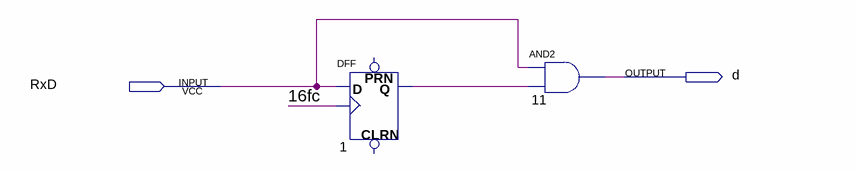
[diagram p0: schematic sheet]
// Quartus schematic sim1_1.bdf as structural Verilog: 2 symbols, 2 pins
module sim1_1 (
  input  RxD,
  output d
);

  wire \16fc , n1_q;

  DFF u_1 (.CLK(\16fc ), .D(RxD), .Q(n1_q));  // open: CLRN, PRN
  and u_11 (d, RxD, n1_q);
endmodule
